# Altium project Backplane3_0.PrjPCB
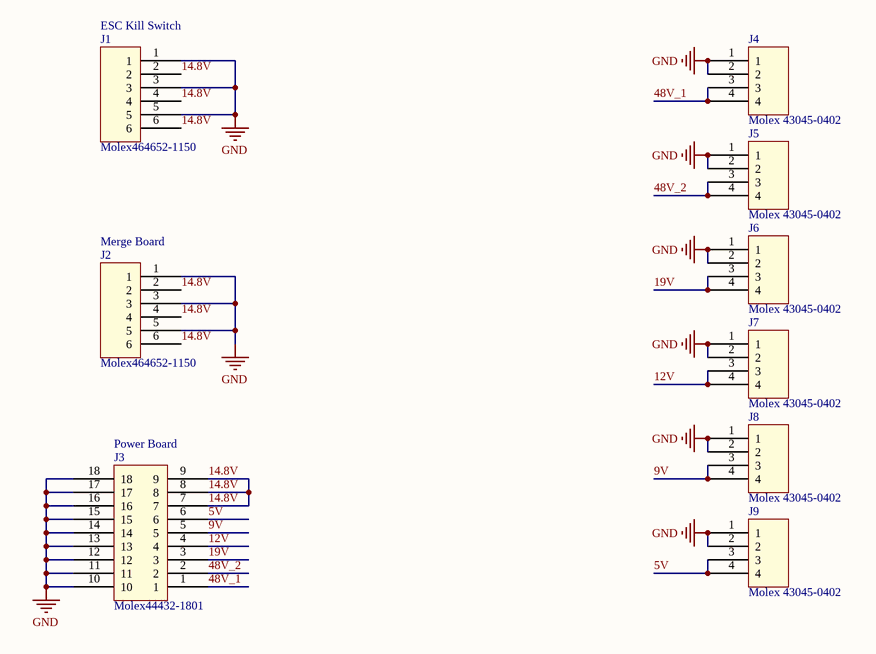
[diagram p0: Backplane3_0.SchDoc]
1 sheet, 9 parts. Net scope: global (net labels, ports and power ports of the same name join across sheets).
Board file: Backplane3_0.PcbDoc

## Sheet Backplane3_0.SchDoc
size A

### Parts
J1  Molex464652-1150  [PCBComponent_1]
J2  Molex464652-1150  [PCBComponent_1]
J3  Molex44432-1801  [Molex44432-1801]
J4  Molex 43045-0402  [Molex43045-0402]
J5  Molex 43045-0402  [Molex43045-0402]
J6  Molex 43045-0402  [Molex43045-0402]
J7  Molex 43045-0402  [Molex43045-0402]
J8  Molex 43045-0402  [Molex43045-0402]
J9  Molex 43045-0402  [Molex43045-0402]

### Nets
GND: J1.1 J1.3 J1.5 J2.1 J2.3 J2.5 J3.10 J3.11 J3.12 J3.13 J3.14 J3.15 J3.16 J3.17 J3.18 J4.1 J4.2 J5.1 J5.2 J6.1 J6.2 J7.1 J7.2 J8.1 J8.2 J9.1 J9.2
5V: J3.6 J9.3 J9.4
9V: J3.5 J8.3 J8.4
12V: J3.4 J7.3 J7.4
14.8V: J1.2 J1.4 J1.6 J2.2 J2.4 J2.6 J3.7 J3.8 J3.9
19V: J3.3 J6.3 J6.4
48V_1: J3.1 J4.3 J4.4
48V_2: J3.2 J5.3 J5.4

### Notes on the sheet
- (near J1) ESC Kill Switch
- (near J2) Merge Board
- (near J3) Power Board

### Library data of the parts
J1 J2 = Molex46562-1150: 2.54mm, 5.50mm Pitch EXTreme Ten60Power Vertical Receptacle Assembly with Guide Receivers, 6 Power Circuits; ComponentLink1Description: Molex Website; ComponentLink1URL: https://www.molex.com/molex/products/datasheet.jsp?part=active/0465621150_PCB_RECEPTACLES.xml
J4-J9 = Molex43045-0402: Micro-Fit 3.0 Right Angle Header, 3.00mm Pitch, Dual Row, 4 Circuits, with Snap-in Plastic Peg PCB Lock, Gold, Glow Wire Capable, Black; ComponentLink1Description: Molex Website; ComponentLink1URL: https://www.molex.com/molex/products/datasheet.jsp?part=active/0430450402_PCB_HEADERS.xml